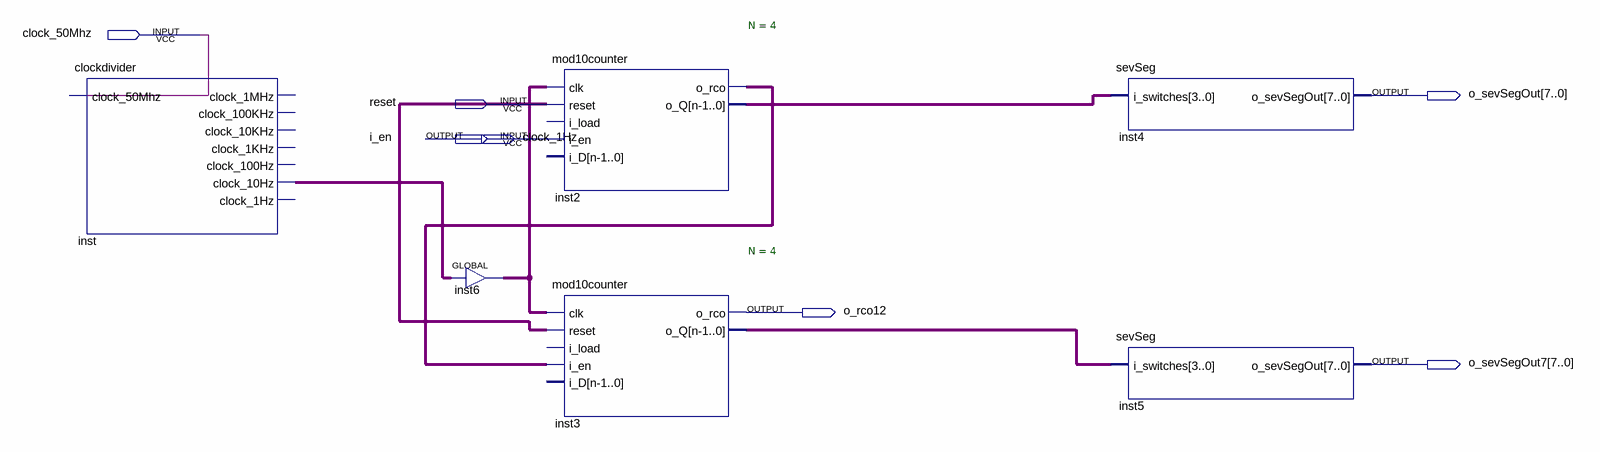
[diagram p0: schematic sheet]
// Quartus schematic twoDigitMod10counter.bdf as structural Verilog: 6 symbols, 7 pins
module twoDigitMod10counter (
  input  clock_50Mhz,
  input  reset,
  input  i_en,
  output [7:0] o_sevSegOut,
  output clock_1Hz,
  output o_rco12,
  output [7:0] o_sevSegOut7
);

  wire inst2_o_rco, inst6_out, inst_clock_10hz;
  wire [3:0] inst2_o_q, inst3_o_q;

  clockdivider inst (
    .clock_50Mhz(clock_50Mhz), .clock_10Hz(inst_clock_10hz));  // open: clock_1MHz, clock_100KHz, clock_10KHz, clock_1KHz, clock_100Hz, clock_1Hz
  GLOBAL inst6 (.IN(inst_clock_10hz), .OUT(inst6_out));
  mod10counter #(.N(4)) inst2 (
    .clk(inst6_out), .reset(reset), .i_en(i_en), .o_rco(inst2_o_rco), .o_Q(inst2_o_q));  // open: i_load, i_D
  mod10counter #(.N(4)) inst3 (
    .clk(inst6_out), .reset(reset), .i_en(inst2_o_rco), .o_rco(o_rco12), .o_Q(inst3_o_q));  // open: i_load, i_D
  sevSeg inst4 (.i_switches(inst2_o_q), .o_sevSegOut(o_sevSegOut));
  sevSeg inst5 (.i_switches(inst3_o_q), .o_sevSegOut(o_sevSegOut7));
endmodule
